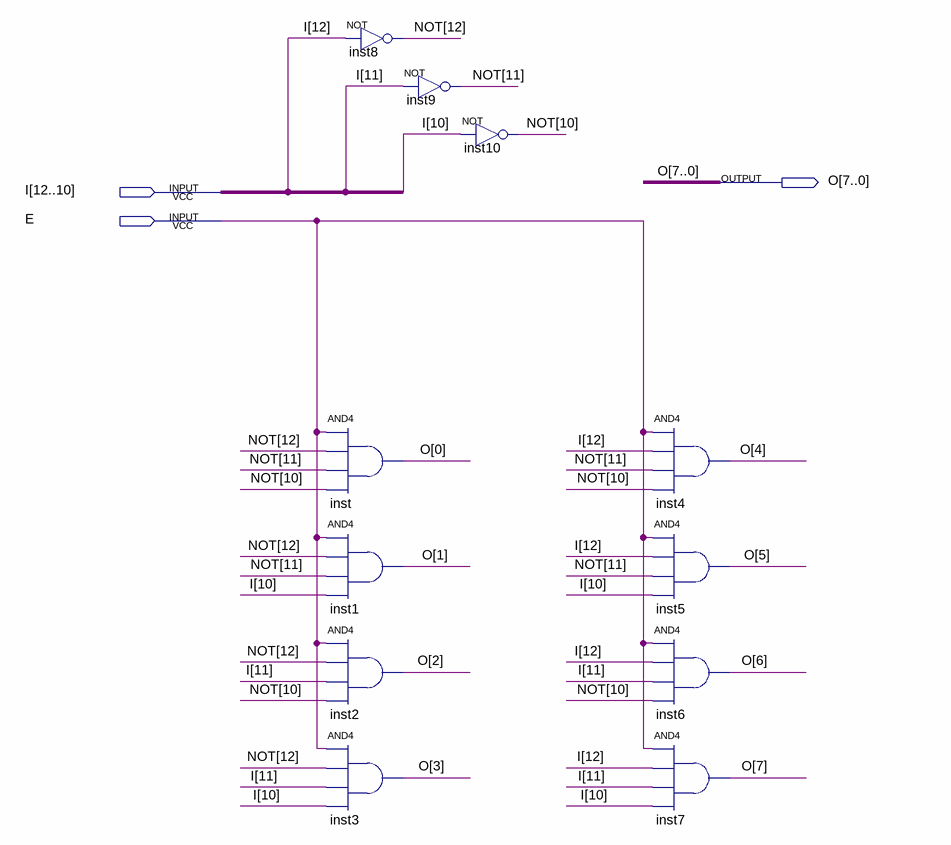
[diagram p0: schematic sheet]
// Quartus schematic Dec3_8_A1.bdf as structural Verilog: 11 symbols, 3 pins
module Dec3_8_A1 (
  input  [12:10] I,
  input  E,
  output [7:0] O
);

  wire [12:10] NOT;

  not inst8 (NOT[12], I[12]);
  and inst (O[0], E, NOT[12], NOT[11], NOT[10]);
  and inst1 (O[1], E, NOT[12], NOT[11], I[10]);
  and inst2 (O[2], E, NOT[12], I[11], NOT[10]);
  and inst3 (O[3], E, NOT[12], I[11], I[10]);
  not inst9 (NOT[11], I[11]);
  not inst10 (NOT[10], I[10]);
  and inst4 (O[4], E, I[12], NOT[11], NOT[10]);
  and inst5 (O[5], E, I[12], NOT[11], I[10]);
  and inst6 (O[6], E, I[12], I[11], NOT[10]);
  and inst7 (O[7], E, I[12], I[11], I[10]);
endmodule
